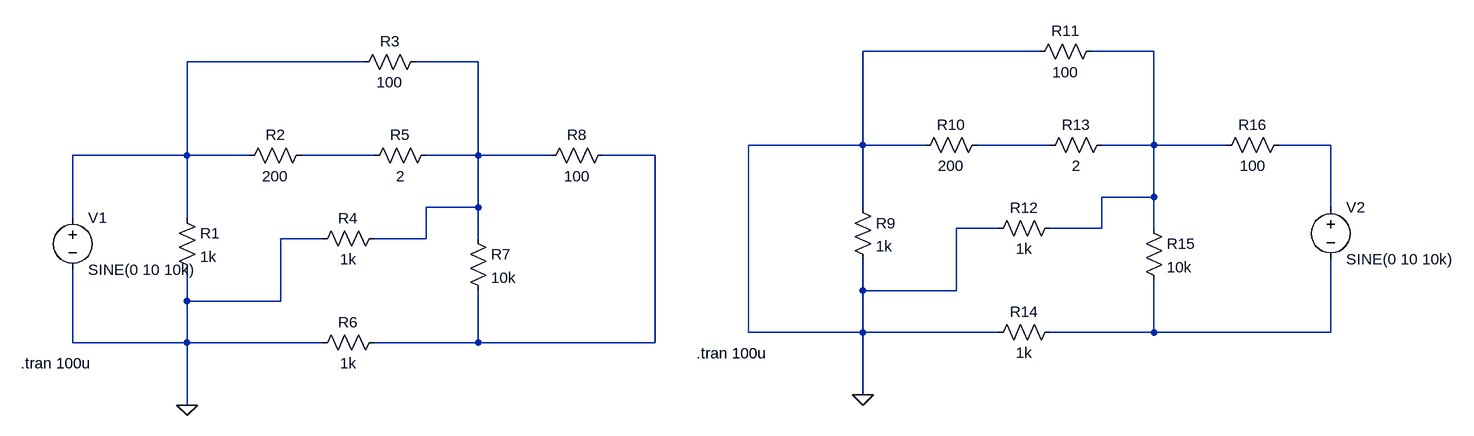
[diagram p0: schematic Schaltung4.asc]
Schaltung4.asc, the LTspice schematic file:
Version 4
SHEET 1 2112 680
WIRE 1456 -96 1184 -96
WIRE 1632 -96 1536 -96
WIRE 416 -80 144 -80
WIRE 592 -80 496 -80
WIRE 1184 48 1184 -96
WIRE 1184 48 1008 48
WIRE 1280 48 1184 48
WIRE 1472 48 1360 48
WIRE 1632 48 1632 -96
WIRE 1632 48 1552 48
WIRE 1744 48 1632 48
WIRE 1904 48 1824 48
WIRE 144 64 144 -80
WIRE 144 64 -32 64
WIRE 240 64 144 64
WIRE 432 64 320 64
WIRE 592 64 592 -80
WIRE 592 64 512 64
WIRE 704 64 592 64
WIRE 864 64 784 64
WIRE 1632 128 1632 48
WIRE 1632 128 1552 128
WIRE 592 144 592 64
WIRE 592 144 512 144
WIRE 1184 144 1184 48
WIRE 1904 144 1904 48
WIRE -32 160 -32 64
WIRE 144 160 144 64
WIRE 1392 176 1328 176
WIRE 1552 176 1552 128
WIRE 1552 176 1472 176
WIRE 1632 176 1632 128
WIRE 352 192 288 192
WIRE 512 192 512 144
WIRE 512 192 432 192
WIRE 592 192 592 144
WIRE 1184 272 1184 224
WIRE 1328 272 1328 176
WIRE 1328 272 1184 272
WIRE 144 288 144 240
WIRE 288 288 288 192
WIRE 288 288 144 288
WIRE 1008 336 1008 48
WIRE 1184 336 1184 272
WIRE 1184 336 1008 336
WIRE 1392 336 1184 336
WIRE 1632 336 1632 256
WIRE 1632 336 1472 336
WIRE 1904 336 1904 224
WIRE 1904 336 1632 336
WIRE -32 352 -32 240
WIRE 144 352 144 288
WIRE 144 352 -32 352
WIRE 352 352 144 352
WIRE 592 352 592 272
WIRE 592 352 432 352
WIRE 864 352 864 64
WIRE 864 352 592 352
WIRE 1184 432 1184 336
WIRE 144 448 144 352
FLAG 144 448 0
FLAG 1184 432 0
SYMBOL voltage -32 144 R0
WINDOW 123 0 0 Left 0
WINDOW 39 0 0 Left 0
SYMATTR InstName V1
SYMATTR Value SINE(0 10 10k)
SYMBOL res 128 144 R0
SYMATTR InstName R1
SYMATTR Value 1k
SYMBOL res 336 48 R90
WINDOW 0 0 56 VBottom 2
WINDOW 3 32 56 VTop 2
SYMATTR InstName R2
SYMATTR Value 200
SYMBOL res 512 -96 R90
WINDOW 0 0 56 VBottom 2
WINDOW 3 32 56 VTop 2
SYMATTR InstName R3
SYMATTR Value 100
SYMBOL res 448 176 R90
WINDOW 0 0 56 VBottom 2
WINDOW 3 32 56 VTop 2
SYMATTR InstName R4
SYMATTR Value 1k
SYMBOL res 528 48 R90
WINDOW 0 0 56 VBottom 2
WINDOW 3 32 56 VTop 2
SYMATTR InstName R5
SYMATTR Value 2
SYMBOL res 448 336 R90
WINDOW 0 0 56 VBottom 2
WINDOW 3 32 56 VTop 2
SYMATTR InstName R6
SYMATTR Value 1k
SYMBOL res 800 48 R90
WINDOW 0 0 56 VBottom 2
WINDOW 3 32 56 VTop 2
SYMATTR InstName R8
SYMATTR Value 100
SYMBOL res 576 176 R0
SYMATTR InstName R7
SYMATTR Value 10k
SYMBOL res 1168 128 R0
SYMATTR InstName R9
SYMATTR Value 1k
SYMBOL res 1376 32 R90
WINDOW 0 0 56 VBottom 2
WINDOW 3 32 56 VTop 2
SYMATTR InstName R10
SYMATTR Value 200
SYMBOL res 1552 -112 R90
WINDOW 0 0 56 VBottom 2
WINDOW 3 32 56 VTop 2
SYMATTR InstName R11
SYMATTR Value 100
SYMBOL res 1488 160 R90
WINDOW 0 0 56 VBottom 2
WINDOW 3 32 56 VTop 2
SYMATTR InstName R12
SYMATTR Value 1k
SYMBOL res 1568 32 R90
WINDOW 0 0 56 VBottom 2
WINDOW 3 32 56 VTop 2
SYMATTR InstName R13
SYMATTR Value 2
SYMBOL res 1488 320 R90
WINDOW 0 0 56 VBottom 2
WINDOW 3 32 56 VTop 2
SYMATTR InstName R14
SYMATTR Value 1k
SYMBOL res 1840 32 R90
WINDOW 0 0 56 VBottom 2
WINDOW 3 32 56 VTop 2
SYMATTR InstName R16
SYMATTR Value 100
SYMBOL res 1616 160 R0
SYMATTR InstName R15
SYMATTR Value 10k
SYMBOL voltage 1904 128 R0
WINDOW 123 0 0 Left 0
WINDOW 39 0 0 Left 0
SYMATTR InstName V2
SYMATTR Value SINE(0 10 10k)
TEXT -112 384 Left 2 !.tran 100u
TEXT 928 368 Left 2 !.tran 100u

The netlist it stands for:
* Schaltung4.asc
V1 N002 0 SINE(0 10 10k)
R1 N002 0 1k
R2 N006 N002 200
R3 N003 N002 100
R4 N003 0 1k
R5 N003 N006 2
R6 N007 0 1k
R8 N007 N003 100
R7 N003 N007 10k
R9 0 0 1k
R10 N004 0 200
R11 N001 0 100
R12 N001 0 1k
R13 N001 N004 2
R14 N008 0 1k
R16 N005 N001 100
R15 N001 N008 10k
V2 N005 N008 SINE(0 10 10k)
.tran 100u
.tran 100u
.backanno
.end